# EAGLE schematic AltStick (EAGLE 6.1)
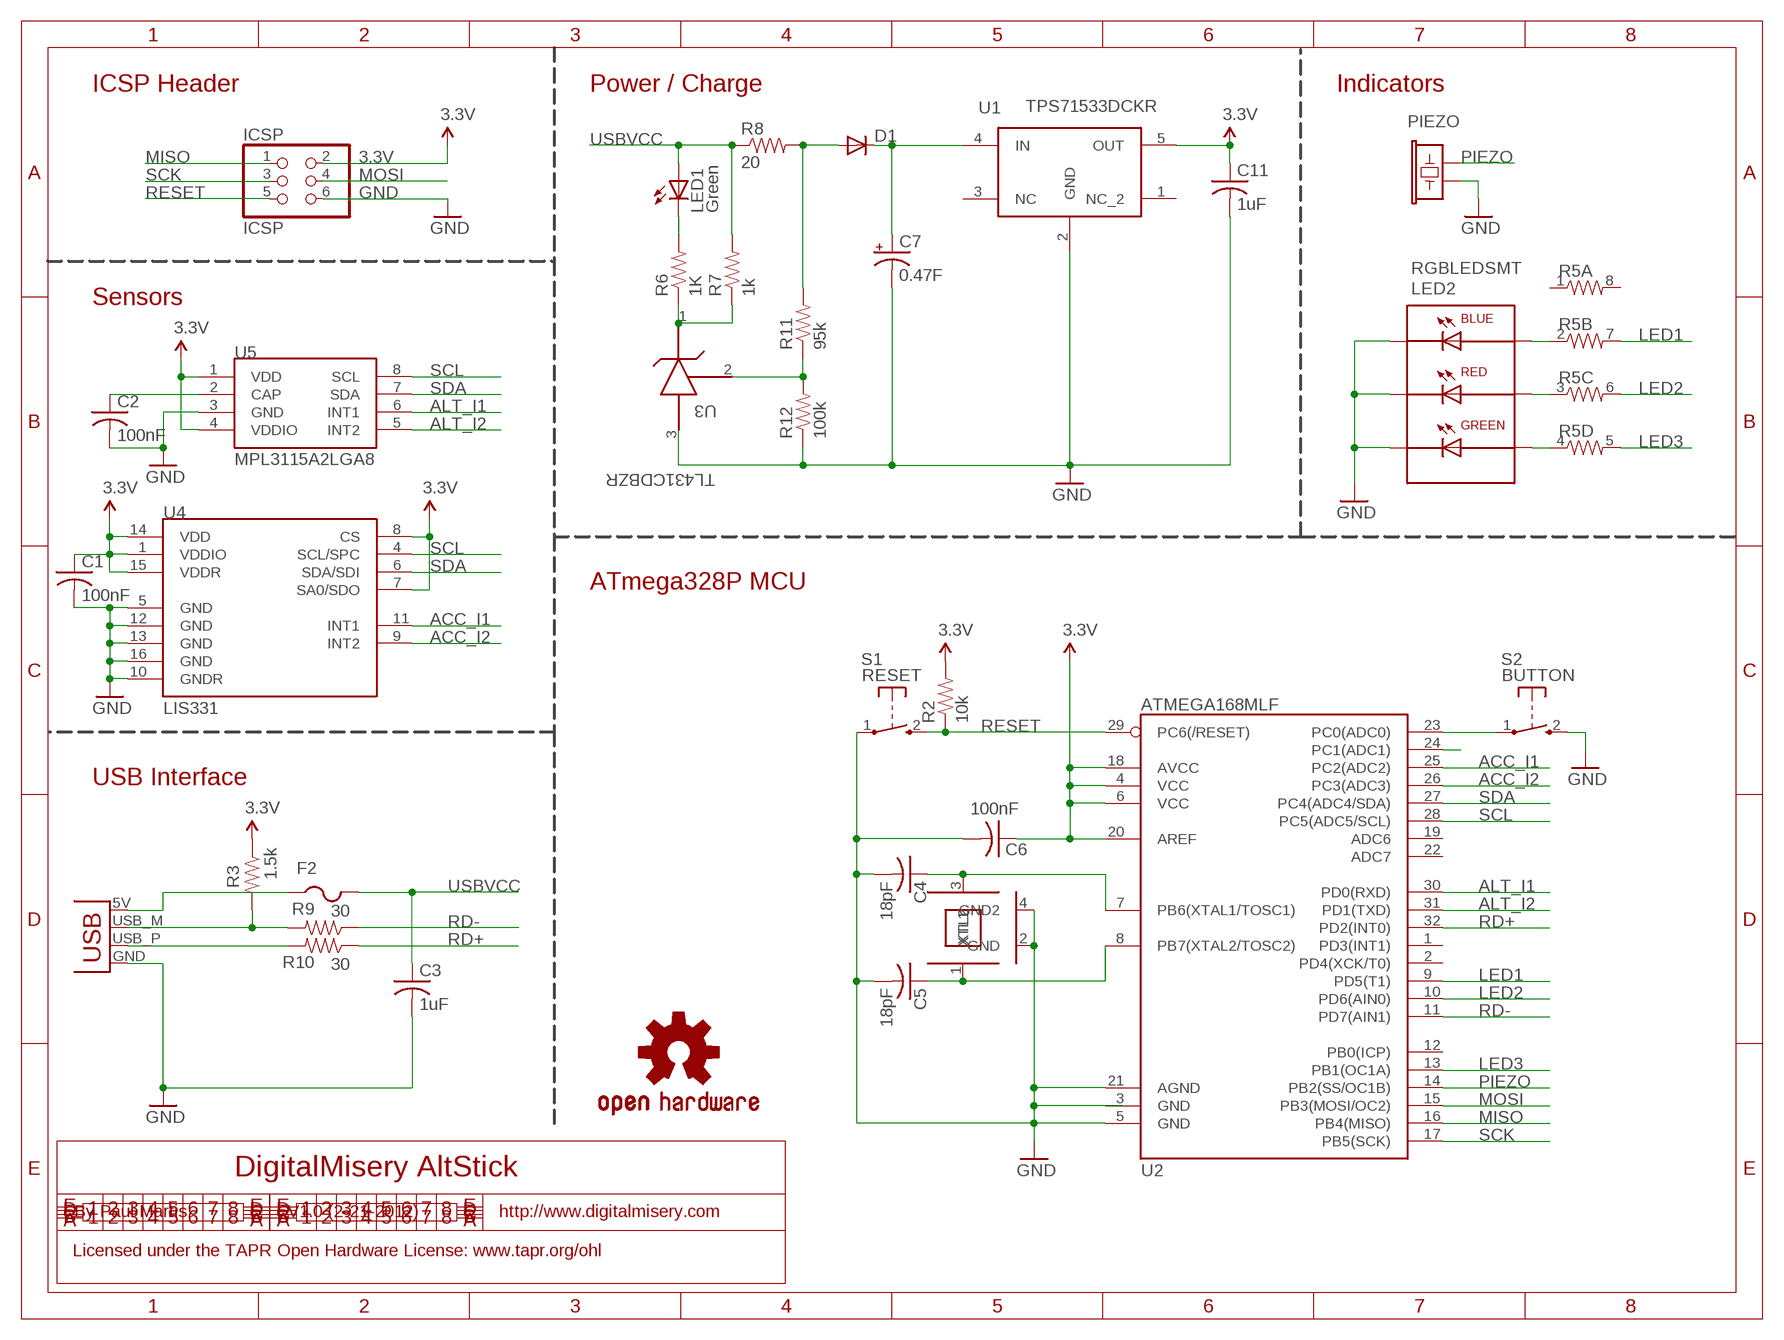
[diagram p0: schematic, sheet 1]

## Parts
C1  100nF  C-USC0603  [C0603]
C2  100nF  C-USC0603  [C0603]
C3  1uF  C-USC0603  [C0603]
C4  18pF  C-USC0603  [C0603]
C5  18pF  C-USC0603  [C0603]
C6  100nF  C-USC0603  [C0603]
C7  0.47F  SUPERCAP  [KR-H11.5]
C11  1uF  C-USC0603  [C0603]
D1  DIODESOD  [SOD-323]
F2  PTCFUSE-1206  [R1206]
ICSP  ICSP  PINHD-2X3  [2X03]
LED1  Green  LED0603  [LED-0603]
LED2  RGBLEDSMT  [19-337]
P1  USBPCB  [USB-A-PCB]
PIEZO  BUZZERSMD12X12  [BUZZER-12X12-SMT]
R2  10k  RESISTOR0603-RES  [0603-RES]
R3  1.5k  RESISTOR0603-RES  [0603-RES]
R5  RESISTOR-ARRAY0603-ARV  [0603-ARV]
R6  1K  RESISTOR0603-RES  [0603-RES]
R7  1k  RESISTOR0603-RES  [0603-RES]
R8  20  RESISTOR0603-RES  [0603-RES]
R9  30  RESISTOR0603-RES  [0603-RES]
R10  30  RESISTOR0603-RES  [0603-RES]
R11  95k  RESISTOR0603-RES  [0603-RES]
R12  100k  RESISTOR0603-RES  [0603-RES]
S1  RESET  TAC_SWITCH_2PIN  [TACTILE_SWITCH_SMD_2PIN_TINY]
S2  BUTTON  TAC_SWITCH_2PIN  [TACTILE_SWITCH_SMD_2PIN_TINY]
U1  TPS71533DCKR  [SOT65P210X110-5N]
U2  ATMEGA168MLF  [MLF32]
U3  TL431CDBZR  [SOT95P237X112-3N]
U4  LIS331  [LGA16-3MM]
U5  MPL3115A2LGA8  [LGA8]
U$2  OSHW-LOGOS  [OSHW-LOGO-S]
XTL1  12MHz  CRYSTAL-GND3X2  [CRYSTAL-SMD-3X2]

## Nets
3.3V: C1.1 C6.1 C11.1 ICSP.2 R2.2 R3.1 U1.5(OUT) U2.4(VCC) U2.6(VCC) U2.18(AVCC) U2.20(AREF) U4.1(VDDIO) U4.7(SA0/SDO) U4.8(CS) U4.14(VDD) U4.15(VDDR) U5.1(VDD) U5.4(VDDIO)
ACC_I1: U2.25(PC2(ADC2)) U4.11(INT1)
ACC_I2: U2.26(PC3(ADC3)) U4.9(INT2)
ALT_I1: U2.30(PD0(RXD)) U5.6(INT1)
ALT_I2: U2.31(PD1(TXD)) U5.5(INT2)
D+: P1.USB_P(D+) R10.2
D-: P1.USB_M(D-) R3.2 R9.2
GND: C1.2 C2.2 C3.2 C4.2 C5.2 C6.2 C7.2(-) C11.2 ICSP.6 LED2.1(C-B) LED2.2(C-R) LED2.3(C-G) P1.GND PIEZO.1 R12.1 S1.1(P) S2.2(S) U1.2(GND) U2.3(GND) U2.5(GND) U2.21(AGND) U3.3(ANODE) U4.5(GND) U4.10(GNDR) U4.12(GND) U4.13(GND) U4.16(GND) U5.3(GND) XTL1.2(GND) XTL1.4(GND2)
LED1: R5.7 U2.9(PD5(T1))
LED2: R5.6 U2.10(PD6(AIN0))
LED3: R5.5 U2.13(PB1(OC1A))
MISO: ICSP.1 U2.16(PB4(MISO))
MOSI: ICSP.4 U2.15(PB3(MOSI/OC2))
N$1: S2.1(P) U2.23(PC0(ADC0))
N$2: F2.1 P1.5V(VBUS)
N$4: LED2.4(A-B) R5.2
N$5: LED2.5(A-R) R5.3
N$6: LED1.C R6.2
N$7: R6.1 R7.1 U3.1(CATHODE)
N$8: R11.1 R12.2 U3.2(REF)
N$9: C7.1(+) D1.1(C) U1.4(IN)
N$10: D1.2(A) R8.2 R11.2
N$11: C4.1 U2.7(PB6(XTAL1/TOSC1)) XTL1.3(XTL2)
N$12: C5.1 U2.8(PB7(XTAL2/TOSC2)) XTL1.1(XTL1)
N$13: LED2.6(A-G) R5.4
N$14: U2.24(PC1(ADC1))
N$15: C2.1 U5.2(CAP)
PIEZO: PIEZO.2 U2.14(PB2(SS/OC1B))
RD+: R10.1 U2.32(PD2(INT0))
RD-: R9.1 U2.11(PD7(AIN1))
RESET: ICSP.5 R2.1 S1.2(S) U2.29(PC6(/RESET))
SCK: ICSP.3 U2.17(PB5(SCK))
SCL: U2.28(PC5(ADC5/SCL)) U4.4(SCL/SPC) U5.8(SCL)
SDA: U2.27(PC4(ADC4/SDA)) U4.6(SDA/SDI) U5.7(SDA)
USBVCC: C3.1 F2.2 LED1.A R7.2 R8.1
Unconnected: R5.1 R5.8 U1.1(NC_2) U1.3(NC) U2.1(PD3(INT1)) U2.2(PD4(XCK/T0)) U2.12(PB0(ICP)) U2.19(ADC6) U2.22(ADC7)

## Notes on the sheet
- ICSP Header | Power / Charge | Indicators
- Sensors
- ATmega328P MCU
- USB Interface
- DigitalMisery AltStick
- By Paul Martis | V1.0 (2-21-2012) | http://www.digitalmisery.com
- Licensed under the TAPR Open Hardware License: www.tapr.org/ohl

## Library data of the parts
C1-C6 C11 = resistor:C-US: CAPACITOR, American symbol
C7 = DigitalMisery:SUPERCAP: Cooper Bussmann® PowerStor® KR-Series Supercapacitor 11.5mm Diameter H-Type Package 10mm lead spacing
D1 = SparkFun-DiscreteSemi:DIODE: Diode These are standard reverse protection diodes and small signal diodes. SMA package can handle up to about 1A. SOD-323 can handle about 200mA. What the SOD-323 package when ordering, there are some mfgs out there that are 5-pin packages.
F2 = adafruit:PTCFUSE: PTC fuses, resettable thermistors
ICSP = pinhead:PINHD-2X3: PIN HEADER
LED1 = SparkFun-LED:LED: LEDs Standard schematic elements and footprints for 5mm, 3mm, 1206, and 0603 sized LEDs. 5mm - Spark Fun Electronics SKU : COM-00529 (and others)
LED2 = freetronics-master-v1:RGBLED
P1 = freetronics-master-v1:USB: USB Connectors USB-B-PTH is fully proven SKU : PRT-00139 USB-miniB is fully proven SKU : PRT-00587 USB-A-PCB is untested. USB-A-H is throughly reviewed, but untested. Spark Fun Electronics SKU : PRT-00437 USB-B-SMT is throughly reviewed, but untested. Needs silkscreen touching up. USB-A-S has not been used/tested USB-MB-H has not been used/tested
PIEZO = freetronics-master-v1:BUZZER: Buzzer - Piezo Transducer
R2 R3 R6-R12 = SparkFun-Passives:RESISTOR: Resistor Basic schematic elements and footprints for 0603, 1206, and PTH resistors.
R5 = SparkFun-Passives:RESISTOR-ARRAY: Array Chip Resistor Source: RS Component / Phycomp
S1 S2 = freetronics-master-v1:TAC_SWITCH_2PIN: Momentary Tactile Switch - 2 pin
U1 = TI TPS71533:TPS71533DCKR; DESCRIPTION: Linear Regulator; MPN: TPS71533DCKR; OC_FARNELL: 1135383; OC_NEWARK: 77C0815; PACKAGE: SC-70-5; SUPPLIER: Texas Instruments
U2 = SparkFun-DigitalIC:ATMEGA168: Atmel 32-pin 8-bit micro, 16k flash.
U3 = TI TL431:TL431CDBZR; DESCRIPTION: PRECISION PROGRAMMABLE REFERENCE; MPN: TL431CDBZR; OC_FARNELL: 1716917; OC_NEWARK: 44J2408; PACKAGE: SOT23-3; SUPPLIER: Texas Instruments
U4 = SparkFun-Sensors:LIS331: 3-axis 6/12/24g SPI/I2C accelerometer
U5 = SparkFun-Sensors:MPL3115A2: Altimeter/Pressure Sensor, I2C, 1.95V-3.6V supply, 50 to 110kPa
U$2 = SparkFun-Aesthetics:OSHW-LOGO: Open Source Hardware Logo This logo indicates the piece of hardware it is found on incorporates a OSHW license and/or adheres to the definition of open source hardware found here: http://freedomdefined.org/OSHW
XTL1 = freetronics-jon:CRYSTAL-GND

## Net classes
0 default: width 0.152 mm, drill 0.241 mm, clearance 0.152 mm